# Altium schematic sheet Overview.SchDoc
size A3; SheetNumber: 1; SheetTotal: 6
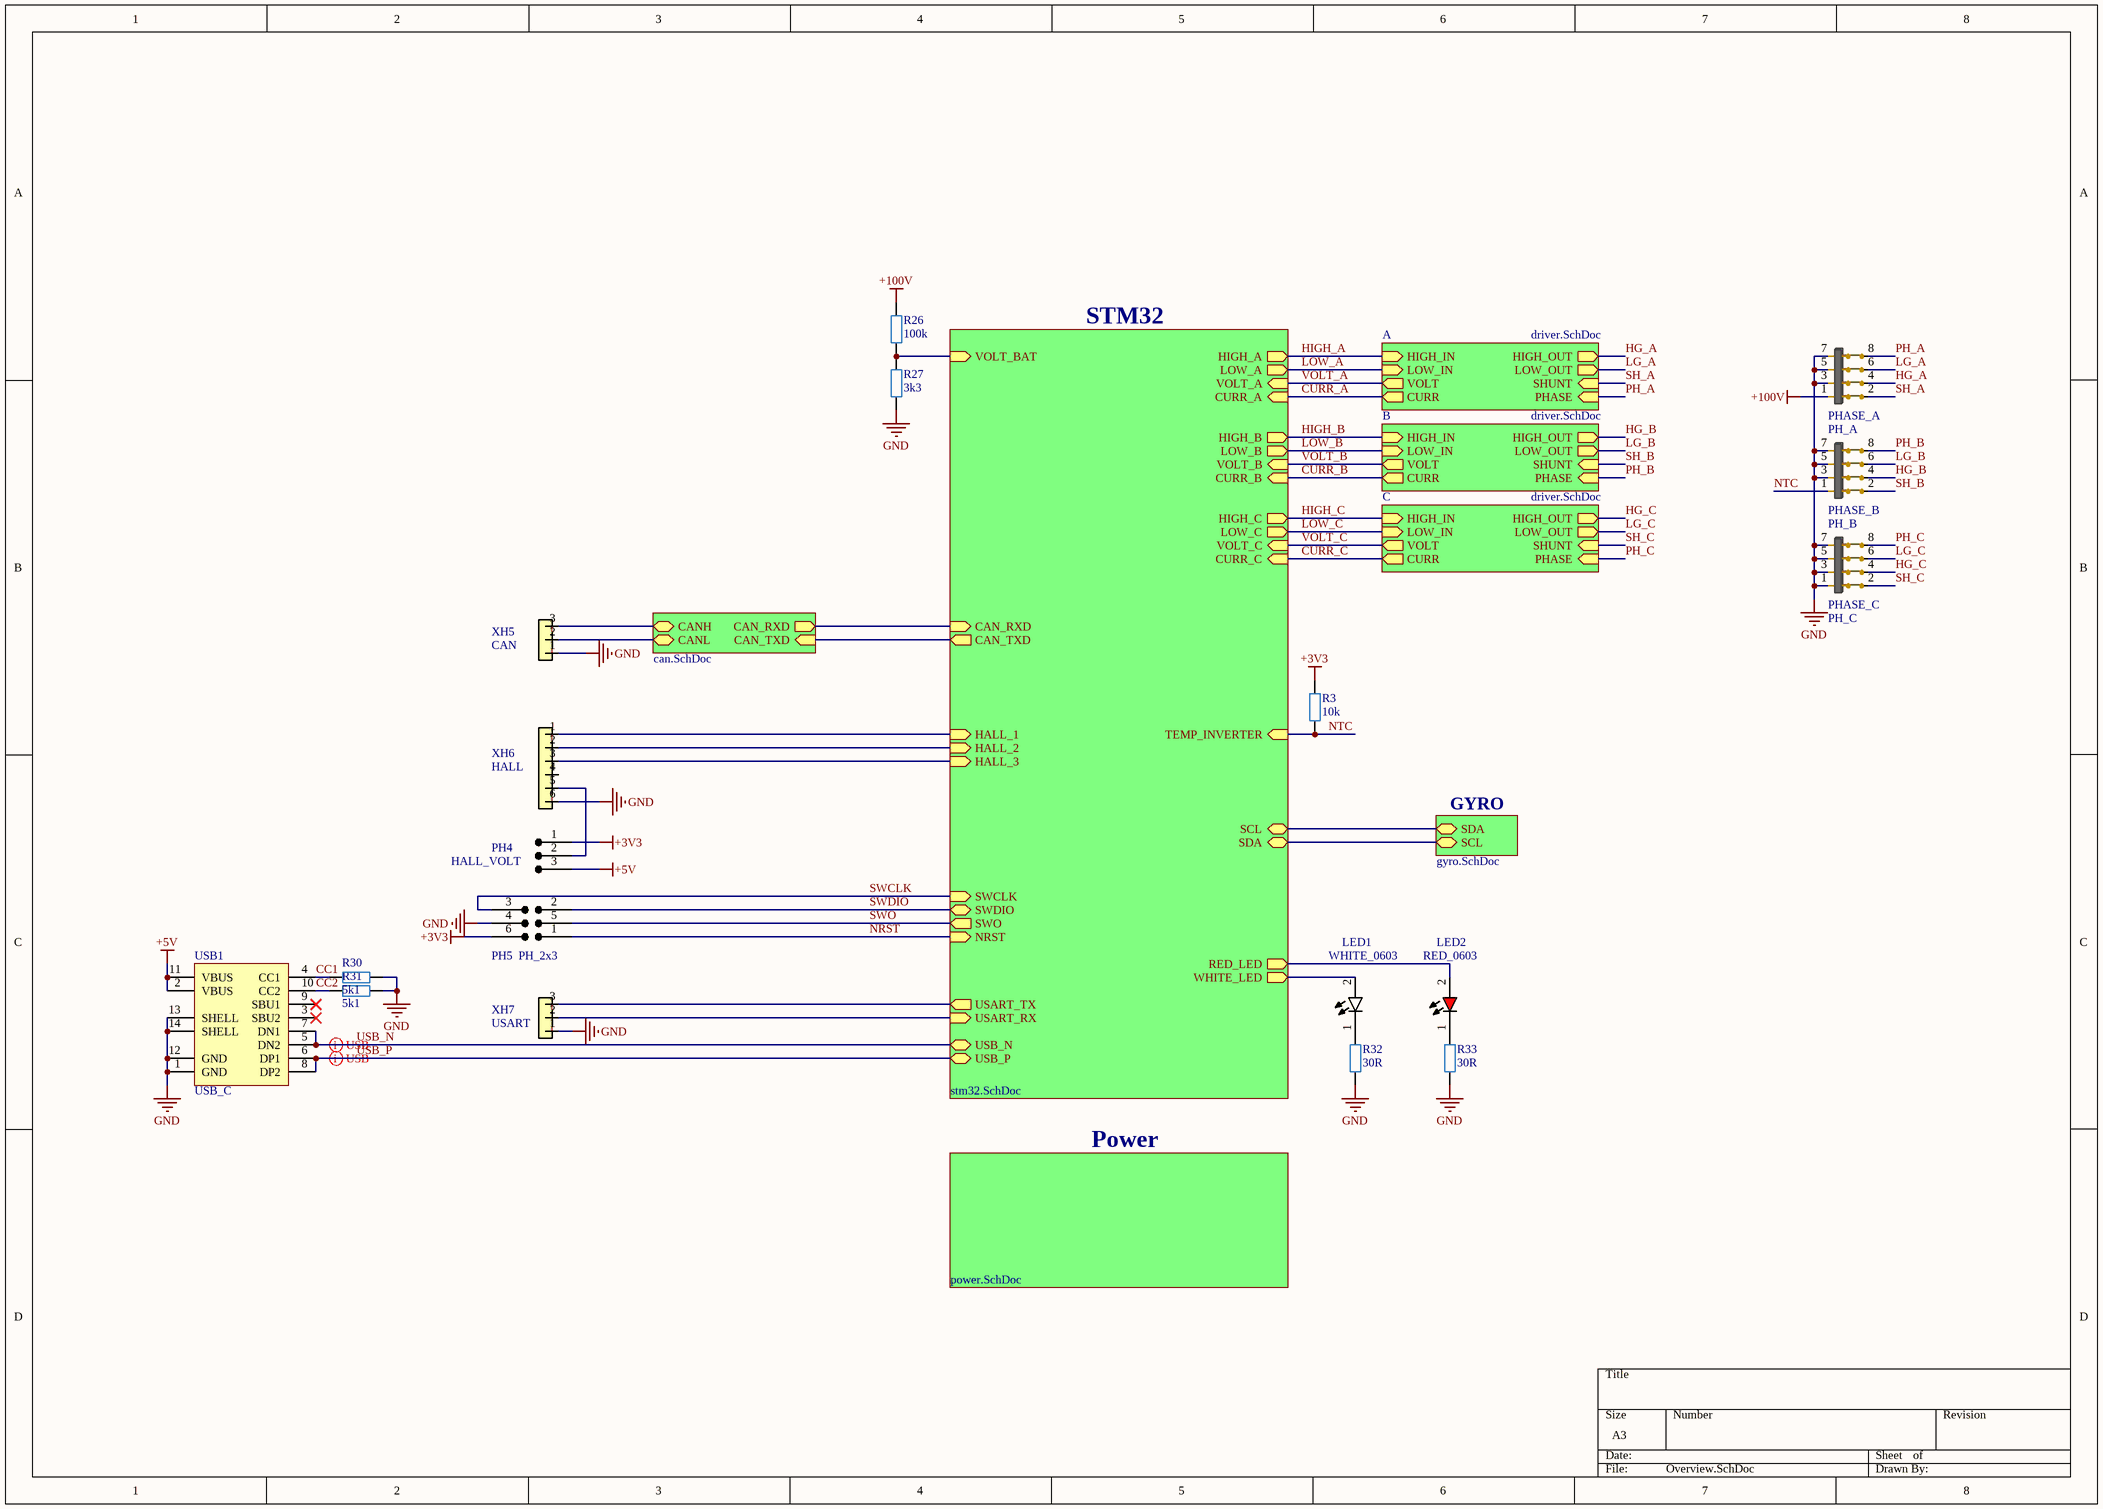
[diagram p0: Overview.SchDoc]

## Parts
LED1  WHITE_0603  [WHITE_0603]
LED2  RED_0603  [RED_0603]
PH4  HALL_VOLT  [PH_1x3]
PH5  PH_2x3  [PH_2x3]
PH_A  PHASE_A  [PH_2x4_M]
PH_B  PHASE_B  [PH_2x4_M]
PH_C  PHASE_C  [PH_2x4_M]
R3  10k  [RES_0603]
R26  100k  [RES_0603]
R27  3k3  [RES_0603]
R30  5k1  [RES_0603]
R31  5k1  [RES_0603]
R32  30R  [RES_0603]
R33  30R  [RES_0603]
USB1  USB_C  [USB_C]
XH5  CAN  [XY-XHB2.54-3A21]
XH6  HALL  [XY-XHB2.54-6A21]
XH7  USART  [XY-XHB2.54-3A21]

## Sub-sheets
A = driver.SchDoc: HIGH_IN (in), LOW_IN (in), HIGH_OUT (out), LOW_OUT (out), VOLT (out), SHUNT (in), PHASE (in), CURR (out)
B = driver.SchDoc: HIGH_IN (in), LOW_IN (in), HIGH_OUT (out), LOW_OUT (out), VOLT (out), SHUNT (in), PHASE (in), CURR (out)
C = driver.SchDoc: HIGH_IN (in), LOW_IN (in), HIGH_OUT (out), LOW_OUT (out), VOLT (out), SHUNT (in), PHASE (in), CURR (out)
CAN = can.SchDoc: CAN_TXD (in), CAN_RXD (out), CANH (bidir), CANL (bidir)
GYRO = gyro.SchDoc: SDA (bidir), SCL (bidir)
Power = power.SchDoc: no entries
STM32 = stm32.SchDoc: VOLT_A (in), VOLT_B (in), VOLT_C (in), CURR_A (in), CURR_B (in), CURR_C (in), HIGH_A (out), HIGH_B (out), HIGH_C (out), LOW_A (out), LOW_B (out), HALL_1 (in), HALL_2 (in), CAN_RXD (in), USART_RX (in), RED_LED (out), WHITE_LED (out), SWO (out), HALL_3 (in), USB_N (bidir), USB_P (bidir), SWDIO (bidir), NRST (in), CAN_TXD (out), USART_TX (out), SWCLK (in), VOLT_BAT (in), TEMP_INVERTER (in), LOW_C (out), SCL (bidir), SDA (bidir)

## Nets
+3V3: PH4.1 PH5.6 R3.2
+5V: PH4.3 USB1.2(VBUS) USB1.11(VBUS)
+100V: PH_A.1 R26.2
GND: PH5.4 PH_A.3 PH_A.5 PH_A.7 PH_B.3 PH_B.5 PH_B.7 PH_C.1 PH_C.3 PH_C.5 PH_C.7 R27.1 R30.2 R31.2 R32.1 R33.1 USB1.1(GND) USB1.12(GND) USB1.13(SHELL) USB1.14(SHELL) XH5.1 XH6.6 XH7.1
CC1: R30.1 USB1.4(CC1)
CC2: R31.1 USB1.10(CC2)
CURR_A: sheet STM32/CURR_A, sheet A/CURR
CURR_B: sheet STM32/CURR_B, sheet B/CURR
CURR_C: sheet STM32/CURR_C, sheet C/CURR
HG_A: PH_A.4 ; sheet A/HIGH_OUT
HG_B: PH_B.4 ; sheet B/HIGH_OUT
HG_C: PH_C.4 ; sheet C/HIGH_OUT
HIGH_A: sheet STM32/HIGH_A, sheet A/HIGH_IN
HIGH_B: sheet STM32/HIGH_B, sheet B/HIGH_IN
HIGH_C: sheet STM32/HIGH_C, sheet C/HIGH_IN
LG_A: PH_A.6 ; sheet A/LOW_OUT
LG_B: PH_B.6 ; sheet B/LOW_OUT
LG_C: PH_C.6 ; sheet C/LOW_OUT
LOW_A: sheet STM32/LOW_A, sheet A/LOW_IN
LOW_B: sheet STM32/LOW_B, sheet B/LOW_IN
LOW_C: sheet STM32/LOW_C, sheet C/LOW_IN
NRST: PH5.1 ; sheet STM32/NRST
NTC: PH_B.1 R3.1 ; sheet STM32/TEMP_INVERTER
PH_A: PH_A.8 ; sheet A/PHASE
PH_B: PH_B.8 ; sheet B/PHASE
PH_C: PH_C.8 ; sheet C/PHASE
SH_A: PH_A.2 ; sheet A/SHUNT
SH_B: PH_B.2 ; sheet B/SHUNT
SH_C: PH_C.2 ; sheet C/SHUNT
SWCLK: PH5.3 ; sheet STM32/SWCLK
SWDIO: PH5.2 ; sheet STM32/SWDIO
SWO: PH5.5 ; sheet STM32/SWO
USB_N: USB1.5(DN2) USB1.7(DN1) ; sheet STM32/USB_N
USB_P: USB1.6(DP1) USB1.8(DP2) ; sheet STM32/USB_P
VOLT_A: sheet STM32/VOLT_A, sheet A/VOLT
VOLT_B: sheet STM32/VOLT_B, sheet B/VOLT
VOLT_C: sheet STM32/VOLT_C, sheet C/VOLT
NetLED1_1: LED1.1(K) R32.2
NetLED1_2: LED1.2(A) ; sheet STM32/WHITE_LED
NetLED2_1: LED2.1(K) R33.2
NetLED2_2: LED2.2(A) ; sheet STM32/RED_LED
NetPH4_2: PH4.2 XH6.5
NetR26_1: R26.1 R27.2 ; sheet STM32/VOLT_BAT
NetXH5_2: XH5.2 ; sheet CAN/CANL
NetXH5_3: XH5.3 ; sheet CAN/CANH
NetXH6_1: XH6.1 ; sheet STM32/HALL_1
NetXH6_2: XH6.2 ; sheet STM32/HALL_2
NetXH6_3: XH6.3 ; sheet STM32/HALL_3
NetXH7_2: XH7.2 ; sheet STM32/USART_RX
NetXH7_3: XH7.3 ; sheet STM32/USART_TX
(unnamed): sheet STM32/CAN_RXD, sheet CAN/CAN_RXD
(unnamed): sheet STM32/CAN_TXD, sheet CAN/CAN_TXD
(unnamed): sheet STM32/SCL, sheet GYRO/SDA
(unnamed): sheet STM32/SDA, sheet GYRO/SCL

Not connected (* = marked no-connect by the designer): USB1 3(SBU2)* 9(SBU1)*; XH6 4

## Layout directives
differential pair: USB_N, USB_P

## Library data of the parts
LED1 = WHITE_0603: 20mA 780mcd Yellow lens -20℃~+85℃ Positive Stick White 130° 70mW 3.3V 0603 LED Indication - Discrete ROHS; Mfr.: XINGLIGHT; Mfr. Part: XL-1608WWC-06; LCSC: C965810; Package: 0603
LED2 = RED_0603: 20mA 330mcd Colorless Transparent Lens -20℃~+85℃ Positive Stick 620nm~630nm Red 120° 50mW 2.3V 0603 LED Indication - Discrete ROHS; Mfr.: XINGLIGHT; Mfr. Part: XL-1608SURC-06; LCSC: C965799; Package: 0603
PH4 = PH_1x3: 2.54mm Pin Headers; Mfr. Part: 2.54-1*3P; Mfr.: BOOMELE(Boom Precision Elec); LCSC: C49257; Package: Plugin,P=2.54mm
PH5 = PH_2x3: 2.54mm Pin Headers
PH_A PH_B PH_C = PH_2x4_M: Policy 2.5mm 8P 6mm -40℃~+105℃ 2.54mm Double Row Black Brass 2x4P Push-Pull,P=2.54mm Pin Headers ROHS; Mfr. Part: PH2.54-07-04PWS; Mfr.: XUNPU; LCSC: C7501618
  PH_A: ClassName: A
  PH_B: ClassName: B
  PH_C: ClassName: C
R3 R26 R27 R30-R33 = RES_0603: 100mW Thick Film Resistors; Voltage Rating: *; Mfr. Part: *; Package: 0603; LCSC: *; Mfr.: *
USB1 = USB_C: Mfr. Part: TYPE-C 16PIN 2MD(073); Mfr.: SHOU HAN; LCSC: C2765186; Package: SMD
XH5 XH7 = XY-XHB2.54-3A21: 1x3P 3P 1 2.54mm 2.54mm 3 -25℃~+85℃ 2A Bend-in Push-Pull,P=2.54mm Wire To Board Connector ROHS; Mfr.: XYECONN; Mfr. Part: XY-XHB2.54-3A21; LCSC: C19271396
XH6 = XY-XHB2.54-6A21: 1x6P 6P 1 2.54mm 2.54mm 6 -25℃~+85℃ 2A Bend-in Push-Pull,P=2.54mm Wire To Board Connector ROHS; Mfr.: XYECONN; Mfr. Part: XY-XHB2.54-6A21; LCSC: C19271399